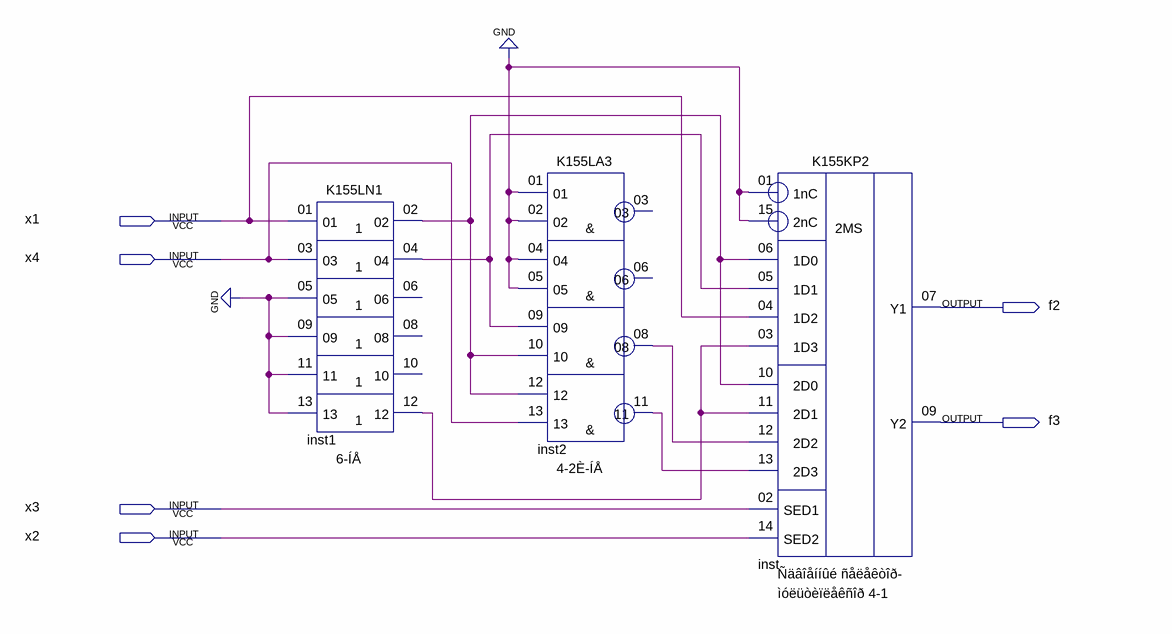
[diagram p0: schematic sheet]
// Quartus schematic two_addr.bdf as structural Verilog: 3 symbols, 6 pins
module two_addr (
  input  x1,
  input  x4,
  input  x3,
  input  x2,
  output f2,
  output f3
);

  wire inst1_02, inst1_04, inst1_12, inst2_08, inst2_11;

  K155LN1 inst1 (
    .\01 (x1), .\03 (x4), .\05 (1'b0), .\09 (1'b0), .\11 (1'b0), .\13 (1'b0), .\02 (inst1_02),
    .\04 (inst1_04), .\12 (inst1_12));  // open: 06, 08, 10
  K155LA3 inst2 (
    .\01 (1'b0), .\02 (1'b0), .\04 (1'b0), .\05 (1'b0), .\09 (inst1_04), .\10 (inst1_02), .\12 (inst1_02),
    .\13 (x4), .\08 (inst2_08), .\11 (inst2_11));  // open: 03, 06
  K155KP2 inst (
    .\1nC (1'b0), .\1D0 (inst1_02), .\1D1 (inst1_04), .\1D2 (x1), .\1D3 (inst1_12), .SED2(x2), .SED1(x3),
    .\2D0 (inst1_02), .\2D1 (inst1_12), .\2D2 (inst2_08), .\2D3 (inst2_11), .\2nC (1'b0), .Y1(f2), .Y2(f3));
endmodule
